# Altium schematic sheet PowerSupply.SchDoc: PowerSupply
size A3; Author: Carlos Barreiro; Organization: Escuela Técnica Superior de Ingeniería de Sistemas Informáticos de la Universidad Politécnica de Madrid; Address1: Campus Sur de la Universidad Politécnica de Madrid; Address2: Calle de Alan Turing, s/nº; Address3: Madrid 28031; Address4: España; DocumentNumber: 11; SheetNumber: 11; SheetTotal: 16
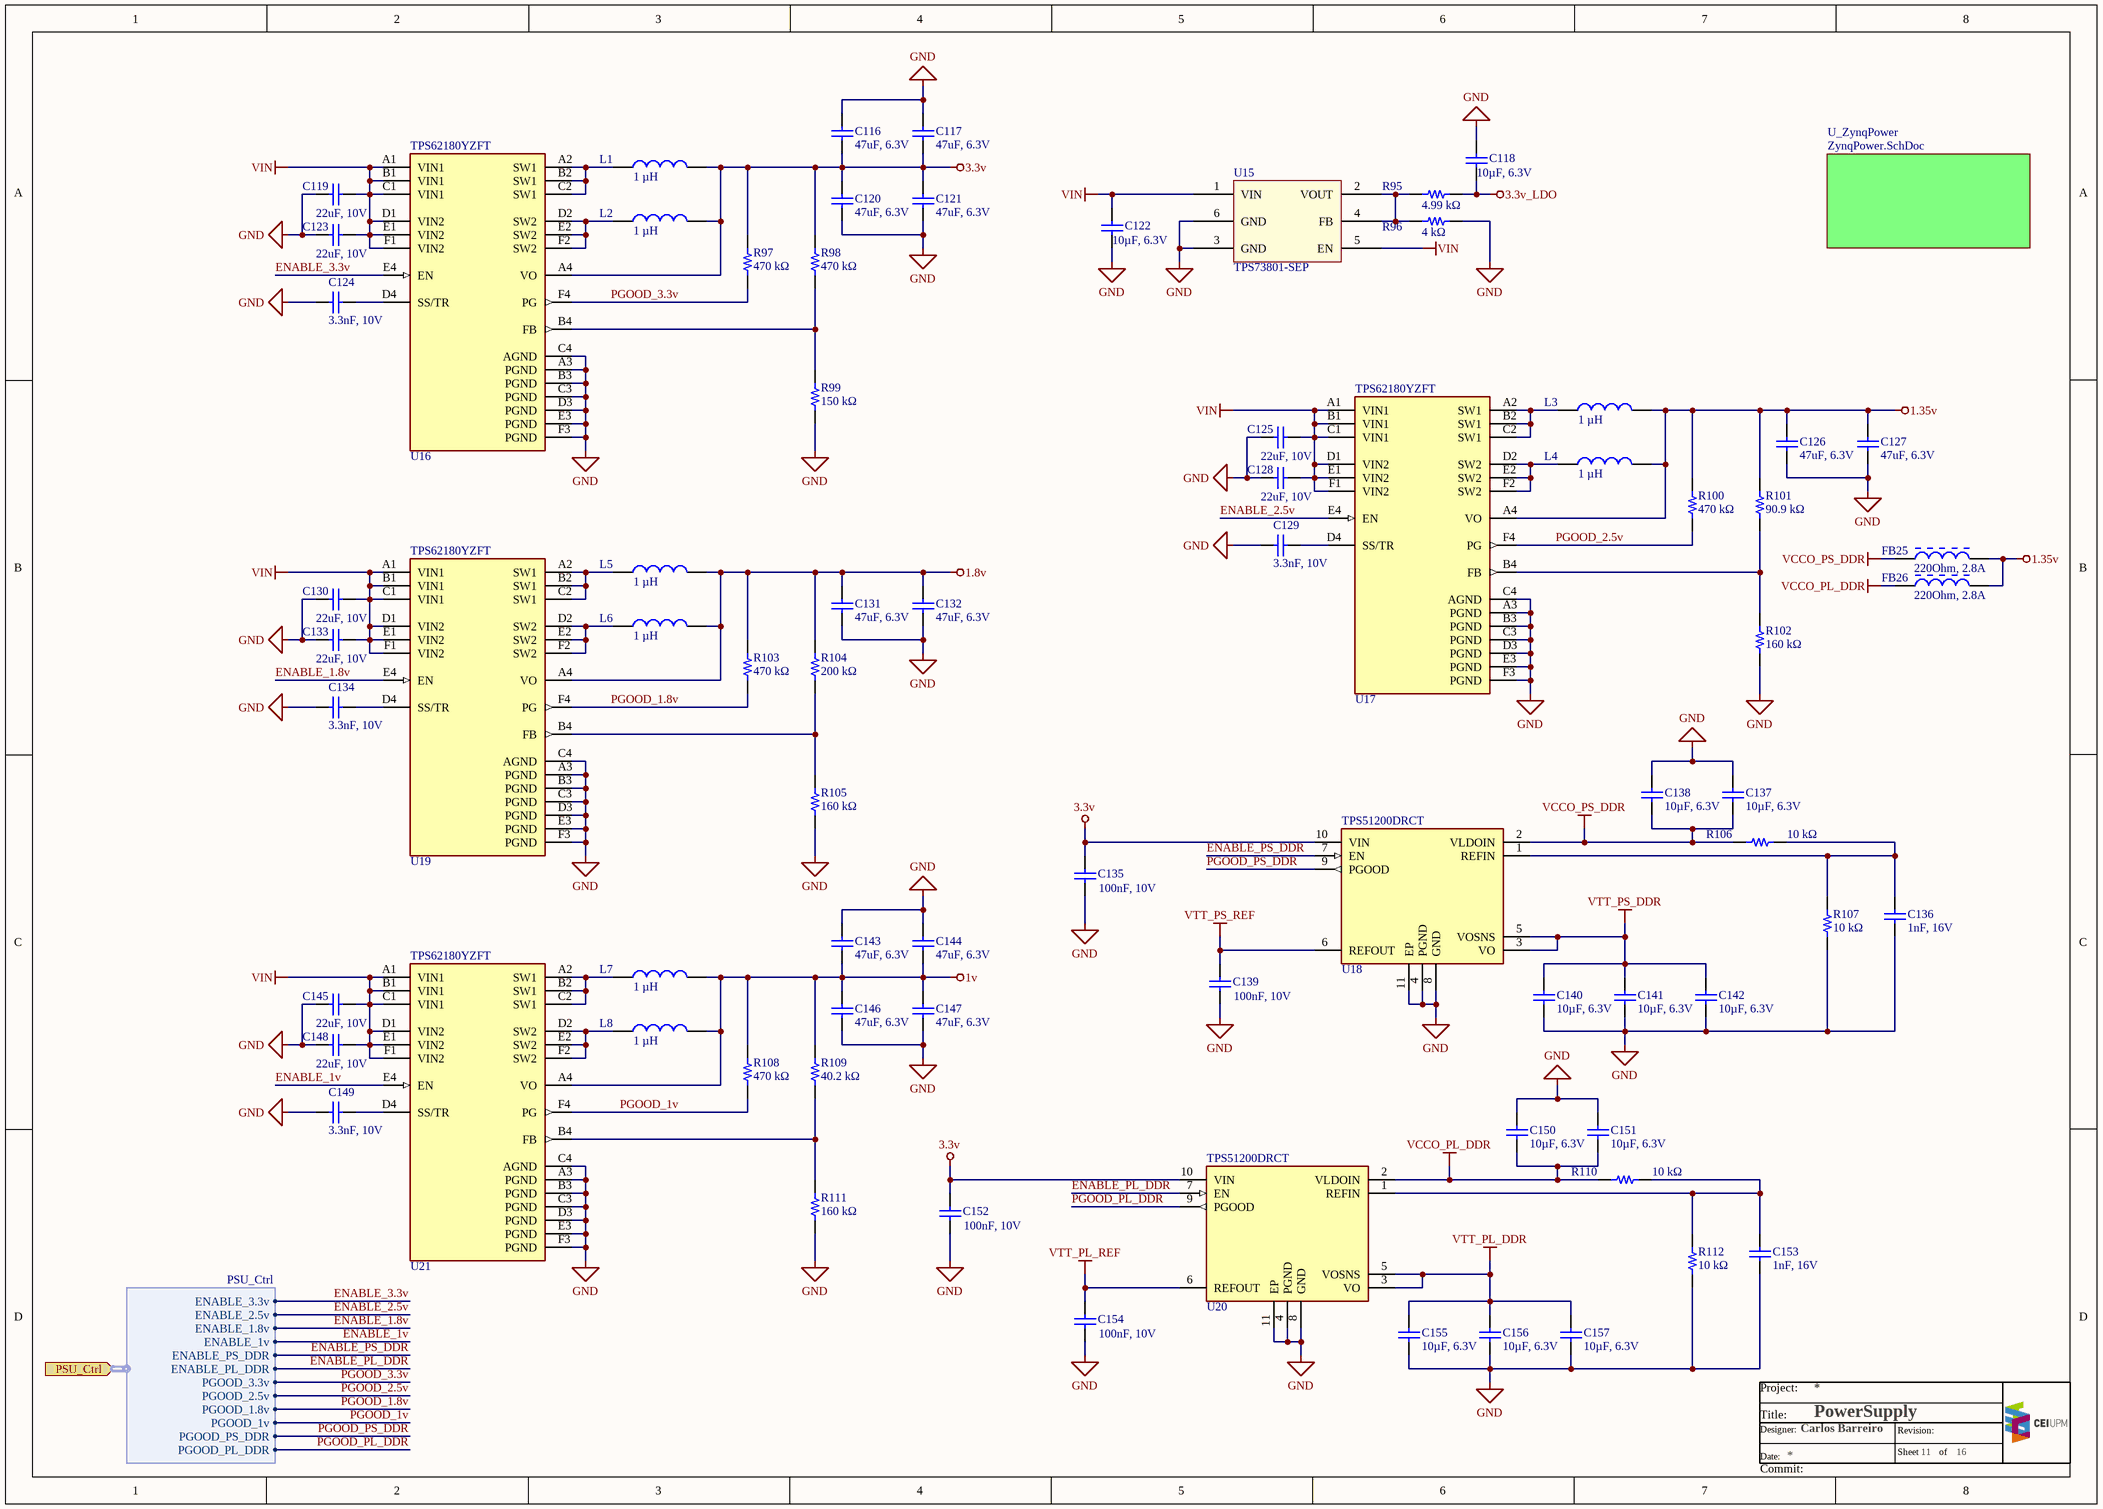
[diagram p0: PowerSupply.SchDoc]

## Parts
C116  47uF, 6.3V  [WURTH_WCAP-CSGP_0805_H=1.25mm]
C117  47uF, 6.3V  [WURTH_WCAP-CSGP_0805_H=1.25mm]
C118  10µF, 6.3V  [WURTH_WCAP-CSGP_0402]
C119  22uF, 10V  [WURTH_WCAP-CSGP_0805_H=1.25mm]
C120  47uF, 6.3V  [WURTH_WCAP-CSGP_0805_H=1.25mm]
C121  47uF, 6.3V  [WURTH_WCAP-CSGP_0805_H=1.25mm]
C122  10µF, 6.3V  [WURTH_WCAP-CSGP_0402]
C123  22uF, 10V  [WURTH_WCAP-CSGP_0805_H=1.25mm]
C124  3.3nF, 10V  [WURTH_WCAP-CSGP_0402]
C125  22uF, 10V  [WURTH_WCAP-CSGP_0805_H=1.25mm]
C126  47uF, 6.3V  [WURTH_WCAP-CSGP_0805_H=1.25mm]
C127  47uF, 6.3V  [WURTH_WCAP-CSGP_0805_H=1.25mm]
C128  22uF, 10V  [WURTH_WCAP-CSGP_0805_H=1.25mm]
C129  3.3nF, 10V  [WURTH_WCAP-CSGP_0402]
C130  22uF, 10V  [WURTH_WCAP-CSGP_0805_H=1.25mm]
C131  47uF, 6.3V  [WURTH_WCAP-CSGP_0805_H=1.25mm]
C132  47uF, 6.3V  [WURTH_WCAP-CSGP_0805_H=1.25mm]
C133  22uF, 10V  [WURTH_WCAP-CSGP_0805_H=1.25mm]
C134  3.3nF, 10V  [WURTH_WCAP-CSGP_0402]
C135  100nF, 10V  [WURTH_WCAP-CSGP_0402]
C136  1nF, 16V  [WURTH_WCAP-CSGP_0402]
C137  10µF, 6.3V  [WURTH_WCAP-CSGP_0402]
C138  10µF, 6.3V  [WURTH_WCAP-CSGP_0402]
C139  100nF, 10V  [WURTH_WCAP-CSGP_0402]
C140  10µF, 6.3V  [WURTH_WCAP-CSGP_0402]
C141  10µF, 6.3V  [WURTH_WCAP-CSGP_0402]
C142  10µF, 6.3V  [WURTH_WCAP-CSGP_0402]
C143  47uF, 6.3V  [WURTH_WCAP-CSGP_0805_H=1.25mm]
C144  47uF, 6.3V  [WURTH_WCAP-CSGP_0805_H=1.25mm]
C145  22uF, 10V  [WURTH_WCAP-CSGP_0805_H=1.25mm]
C146  47uF, 6.3V  [WURTH_WCAP-CSGP_0805_H=1.25mm]
C147  47uF, 6.3V  [WURTH_WCAP-CSGP_0805_H=1.25mm]
C148  22uF, 10V  [WURTH_WCAP-CSGP_0805_H=1.25mm]
C149  3.3nF, 10V  [WURTH_WCAP-CSGP_0402]
C150  10µF, 6.3V  [WURTH_WCAP-CSGP_0402]
C151  10µF, 6.3V  [WURTH_WCAP-CSGP_0402]
C152  100nF, 10V  [WURTH_WCAP-CSGP_0402]
C153  1nF, 16V  [WURTH_WCAP-CSGP_0402]
C154  100nF, 10V  [WURTH_WCAP-CSGP_0402]
C155  10µF, 6.3V  [WURTH_WCAP-CSGP_0402]
C156  10µF, 6.3V  [WURTH_WCAP-CSGP_0402]
C157  10µF, 6.3V  [WURTH_WCAP-CSGP_0402]
FB25  220Ohm, 2.8A  [WURTH-CBF_0805]
FB26  220Ohm, 2.8A  [WURTH-CBF_0805]
L1  1 µH  [Murata_LQH2HPN_JR]
L2  1 µH  [Murata_LQH2HPN_JR]
L3  1 µH  [Murata_LQH2HPN_JR]
L4  1 µH  [Murata_LQH2HPN_JR]
L5  1 µH  [Murata_LQH2HPN_JR]
L6  1 µH  [Murata_LQH2HPN_JR]
L7  1 µH  [Murata_LQH2HPN_JR]
L8  1 µH  [Murata_LQH2HPN_JR]
R95  4.99 kΩ  [PANASONIC_ERJ2G_0402]
R96  4 kΩ  [PANASONIC_ERJ2G_0402]
R97  470 kΩ  [PANASONIC_ERJ2G_0402]
R98  470 kΩ  [PANASONIC_ERJ2G_0402]
R99  150 kΩ  [PANASONIC_ERJ2G_0402]
R100  470 kΩ  [PANASONIC_ERJ2G_0402]
R101  90.9 kΩ  [PANASONIC_ERJ2G_0402]
R102  160 kΩ  [PANASONIC_ERJ2G_0402]
R103  470 kΩ  [PANASONIC_ERJ2G_0402]
R104  200 kΩ  [PANASONIC_ERJ2G_0402]
R105  160 kΩ  [PANASONIC_ERJ2G_0402]
R106  10 kΩ  [PANASONIC_ERJ2G_0402]
R107  10 kΩ  [PANASONIC_ERJ2G_0402]
R108  470 kΩ  [PANASONIC_ERJ2G_0402]
R109  40.2 kΩ  [PANASONIC_ERJ2G_0402]
R110  10 kΩ  [PANASONIC_ERJ2G_0402]
R111  160 kΩ  [PANASONIC_ERJ2G_0402]
R112  10 kΩ  [PANASONIC_ERJ2G_0402]
U15  TPS73801-SEP  [TEXAS_SOT223DCQ]
U16  TPS62180YZFT  [TEXAS_DSBGA24]
U17  TPS62180YZFT  [TEXAS_DSBGA24]
U18  TPS51200DRCT  [TEXAS_VSON10]
U19  TPS62180YZFT  [TEXAS_DSBGA24]
U20  TPS51200DRCT  [TEXAS_VSON10]
U21  TPS62180YZFT  [TEXAS_DSBGA24]

## Sub-sheets
U_ZynqPower = ZynqPower.SchDoc: no entries

## Ports
PSU_Ctrl (in, harness PSU_Ctrl)

## Harnesses
PSU_Ctrl: ENABLE_3.3v, ENABLE_2.5v, ENABLE_1.8v, ENABLE_1v, ENABLE_PS_DDR, ENABLE_PL_DDR, PGOOD_3.3v, PGOOD_2.5v, PGOOD_1.8v, PGOOD_1v, PGOOD_PS_DDR, PGOOD_PL_DDR

## Nets
1.8v: C131.2 C132.2 L5.2 L6.2 R103.2 R104.2 U19.A4(VO)
1.35v: C126.2 C127.2 FB25.2 FB26.2 L3.2 L4.2 R100.2 R101.2 U17.A4(VO)
1v: C143.1 C144.1 C146.2 C147.2 L7.2 L8.2 R108.2 R109.2 U21.A4(VO)
3.3v: C116.1 C117.1 C120.2 C121.2 C135.2 C152.2 L1.2 L2.2 R97.2 R98.2 U16.A4(VO) U18.10(VIN) U20.10(VIN)
3.3v_LDO: C118.1 R95.2
GND: C116.2 C117.2 C118.2 C119.2 C120.1 C121.1 C122.1 C123.2 C124.1 C125.2 C126.1 C127.1 C128.2 C129.1 C130.2 C131.1 C132.1 C133.2 C134.1 C135.1 C136.2 C137.1 C138.1 C139.1 C140.1 C141.1 C142.1 C143.2 C144.2 C145.2 C146.1 C147.1 C148.2 C149.1 C150.1 C151.1 C152.1 C153.2 C154.1 C155.1 C156.1 C157.1 R96.2 R99.1 R102.1 R105.1 R107.1 R111.1 R112.1 U15.3(GND) U15.6(GND) U16.A3(PGND) U16.B3(PGND) U16.C3(PGND) U16.C4(AGND) U16.D3(PGND) U16.E3(PGND) U16.F3(PGND) U17.A3(PGND) U17.B3(PGND) U17.C3(PGND) U17.C4(AGND) U17.D3(PGND) U17.E3(PGND) U17.F3(PGND) U18.4(PGND) U18.8(GND) U18.11(EP) U19.A3(PGND) U19.B3(PGND) U19.C3(PGND) U19.C4(AGND) U19.D3(PGND) U19.E3(PGND) U19.F3(PGND) U20.4(PGND) U20.8(GND) U20.11(EP) U21.A3(PGND) U21.B3(PGND) U21.C3(PGND) U21.C4(AGND) U21.D3(PGND) U21.E3(PGND) U21.F3(PGND)
VCCO_PL_DDR: C150.2 C151.2 FB26.1 R110.1 U20.2(VLDOIN)
VCCO_PS_DDR: C137.2 C138.2 FB25.1 R106.1 U18.2(VLDOIN)
VIN: C119.1 C122.2 C123.1 C125.1 C128.1 C130.1 C133.1 C145.1 C148.1 U15.1(VIN) U15.5(EN) U16.A1(VIN1) U16.B1(VIN1) U16.C1(VIN1) U16.D1(VIN2) U16.E1(VIN2) U16.F1(VIN2) U17.A1(VIN1) U17.B1(VIN1) U17.C1(VIN1) U17.D1(VIN2) U17.E1(VIN2) U17.F1(VIN2) U19.A1(VIN1) U19.B1(VIN1) U19.C1(VIN1) U19.D1(VIN2) U19.E1(VIN2) U19.F1(VIN2) U21.A1(VIN1) U21.B1(VIN1) U21.C1(VIN1) U21.D1(VIN2) U21.E1(VIN2) U21.F1(VIN2)
VTT_PL_DDR: C155.2 C156.2 C157.2 U20.3(VO) U20.5(VOSNS)
VTT_PL_REF: C154.2 U20.6(REFOUT)
VTT_PS_DDR: C140.2 C141.2 C142.2 U18.3(VO) U18.5(VOSNS)
VTT_PS_REF: C139.2 U18.6(REFOUT)
ENABLE_1.8v: U19.E4(EN) ; port PSU_Ctrl.ENABLE_1.8v
ENABLE_1v: U21.E4(EN) ; port PSU_Ctrl.ENABLE_1v
ENABLE_2.5v: U17.E4(EN) ; port PSU_Ctrl.ENABLE_2.5v
ENABLE_3.3v: U16.E4(EN) ; port PSU_Ctrl.ENABLE_3.3v
ENABLE_PL_DDR: U20.7(EN) ; port PSU_Ctrl.ENABLE_PL_DDR
ENABLE_PS_DDR: U18.7(EN) ; port PSU_Ctrl.ENABLE_PS_DDR
PGOOD_1.8v: R103.1 U19.F4(PG) ; port PSU_Ctrl.PGOOD_1.8v
PGOOD_1v: R108.1 U21.F4(PG) ; port PSU_Ctrl.PGOOD_1v
PGOOD_2.5v: R100.1 U17.F4(PG) ; port PSU_Ctrl.PGOOD_2.5v
PGOOD_3.3v: R97.1 U16.F4(PG) ; port PSU_Ctrl.PGOOD_3.3v
PGOOD_PL_DDR: U20.9(PGOOD) ; port PSU_Ctrl.PGOOD_PL_DDR
PGOOD_PS_DDR: U18.9(PGOOD) ; port PSU_Ctrl.PGOOD_PS_DDR
NetC124_2: C124.2 U16.D4(SS/TR)
NetC129_2: C129.2 U17.D4(SS/TR)
NetC134_2: C134.2 U19.D4(SS/TR)
NetC136_1: C136.1 R106.2 R107.2 U18.1(REFIN)
NetC149_2: C149.2 U21.D4(SS/TR)
NetC153_1: C153.1 R110.2 R112.2 U20.1(REFIN)
NetL1_1: L1.1 U16.A2(SW1) U16.B2(SW1) U16.C2(SW1)
NetL2_1: L2.1 U16.D2(SW2) U16.E2(SW2) U16.F2(SW2)
NetL3_1: L3.1 U17.A2(SW1) U17.B2(SW1) U17.C2(SW1)
NetL4_1: L4.1 U17.D2(SW2) U17.E2(SW2) U17.F2(SW2)
NetL5_1: L5.1 U19.A2(SW1) U19.B2(SW1) U19.C2(SW1)
NetL6_1: L6.1 U19.D2(SW2) U19.E2(SW2) U19.F2(SW2)
NetL7_1: L7.1 U21.A2(SW1) U21.B2(SW1) U21.C2(SW1)
NetL8_1: L8.1 U21.D2(SW2) U21.E2(SW2) U21.F2(SW2)
NetR95_1: R95.1 R96.1 U15.2(VOUT) U15.4(FB)
NetR98_1: R98.1 R99.2 U16.B4(FB)
NetR101_1: R101.1 R102.2 U17.B4(FB)
NetR104_1: R104.1 R105.2 U19.B4(FB)
NetR109_1: R109.1 R111.2 U21.B4(FB)

## Notes on the sheet
- Project:
- Title:
- Date:
- Designer:
- Sheet
- Revision:
- of
- Commit:

## Library data of the parts
C116 C117 C120 C121 C126 C127 C131 C132 C143 C144 C146 C147 = 885012107006: WCAP-CSGP Multilayer Ceramic Chip Capacitor, General Purpose, size 0805, X5R, 47uF, 6.3V; Manufacturer: Wurth Elektronik; Rated Voltage: 6.3VDC; Isolation Resistance  min.: 0.002GOhm; Capacitance Tolerance: +/-20%; Dissipation Factor max.: 10%; Technical Reference: X5R0805476M6R3DFCT10000; ComponentLink1Description: Manufacturer; ComponentLink1URL: http://www.we-online.de; ComponentLink2Description: Datasheet; ComponentLink2URL: https://www.we-online.com/catalog/datasheet/885012107006.pdf; Operating Temperature: -55 to +85degC; Packaging: Tape and Reel; Manufacturer Part Number: 885012107006; Published Date: April 2021; Ceramic Type: X5R; Height: 1.25mm; Mounting Technology: SMT; Size: 0805; Capacitance: 47uF; Q-Factor min.: -
C118 C122 C137 C138 C140-C142 C150 C151 C155-C157 = 885012105020: WCAP-CSGP Multilayer Ceramic Chip Capacitor, General Purpose, size 0402, X5R, 10uF, 6.3V; Manufacturer: Wurth Elektronik; Rated Voltage: 6.3VDC; Isolation Resistance  min.: 0.01GOhm; Capacitance Tolerance: +/20%; Dissipation Factor max.: 10%; Technical Reference: X5R0402106M6R3DFCT10000; ComponentLink1Description: Manufacturer; ComponentLink1URL: http://www.we-online.de; ComponentLink2Description: Datasheet; ComponentLink2URL: https://www.we-online.com/catalog/datasheet/885012105020.pdf; Operating Temperature: -55 to +85degC; Packaging: Tape and Reel; Manufacturer Part Number: 885012105020; Published Date: April 2021; Ceramic Type: X5R; Height: 0.5mm; Mounting Technology: SMT; Size: 0402; Capacitance: 10uF; Q-Factor min.: -
C119 C123 C125 C128 C130 C133 C145 C148 = 885012107011: WCAP-CSGP Multilayer Ceramic Chip Capacitor, General Purpose, size 0805, X5R, 22uF, 10V; Manufacturer: Wurth Elektronik; Rated Voltage: 10VDC; Isolation Resistance  min.: 0.005GOhm; Capacitance Tolerance: +/-20%; Dissipation Factor max.: 10%; Technical Reference: X5R0805226M010DFCT10000; ComponentLink1Description: Manufacturer; ComponentLink1URL: http://www.we-online.de; ComponentLink2Description: Datasheet; ComponentLink2URL: https://www.we-online.com/catalog/datasheet/885012107011.pdf; Operating Temperature: -55 to +85degC; Packaging: Tape and Reel; Manufacturer Part Number: 885012107011; Published Date: April 2021; Ceramic Type: X5R; Height: 1.25mm; Mounting Technology: SMT; Size: 0805; Capacitance: 22uF; Q-Factor min.: -
C124 C129 C134 C149 = 885012205009: WCAP-CSGP Multilayer Ceramic Chip Capacitor, General Purpose, size 0402, X7R, 3.3nF, 10V; Manufacturer: Wurth Elektronik; Rated Voltage: 10VDC; Isolation Resistance  min.: 10GOhm; Capacitance Tolerance: +/-10%; Dissipation Factor max.: 5%; Technical Reference: X7R0402332K010DFCT10000; ComponentLink1Description: Manufacturer; ComponentLink1URL: http://www.we-online.de; ComponentLink2Description: Datasheet; ComponentLink2URL: https://www.we-online.com/catalog/datasheet/885012205009.pdf; Operating Temperature: -55 to +125degC; Packaging: Tape and Reel; Manufacturer Part Number: 885012205009; Published Date: April 2021; Ceramic Type: X7R; Height: 0.5mm; Mounting Technology: SMT; Size: 0402; Capacitance: 3.3nF; Q-Factor min.: -
C135 C139 C152 C154 = 885012205018: WCAP-CSGP Multilayer Ceramic Chip Capacitor, General Purpose, size 0402, X7R, 100nF, 10V; Manufacturer: Wurth Elektronik; Rated Voltage: 10VDC; Isolation Resistance  min.: 5GOhm; Capacitance Tolerance: +/-10%; Dissipation Factor max.: 5%; Technical Reference: X7R0402104K010DFCT10000; ComponentLink1Description: Manufacturer; ComponentLink1URL: http://www.we-online.de; ComponentLink2Description: Datasheet; ComponentLink2URL: https://www.we-online.com/catalog/datasheet/885012205018.pdf; Operating Temperature: -55 to +125degC; Packaging: Tape and Reel; Manufacturer Part Number: 885012205018; Published Date: April 2021; Ceramic Type: X7R; Height: 0.5mm; Mounting Technology: SMT; Size: 0402; Capacitance: 100nF; Q-Factor min.: -
C136 C153 = 885012205025: WCAP-CSGP Multilayer Ceramic Chip Capacitor, General Purpose, size 0402, X7R, 1nF, 16V; Manufacturer: Wurth Elektronik; Rated Voltage: 16VDC; Isolation Resistance  min.: 10GOhm; Capacitance Tolerance: +/-10%; Dissipation Factor max.: 3.5%; Technical Reference: X7R0402102K016DFCT10000; ComponentLink1Description: Manufacturer; ComponentLink1URL: http://www.we-online.de; ComponentLink2Description: Datasheet; ComponentLink2URL: https://www.we-online.com/catalog/datasheet/885012205025.pdf; Operating Temperature: -55 to +125degC; Packaging: Tape and Reel; Manufacturer Part Number: 885012205025; Published Date: April 2021; Ceramic Type: X7R; Height: 0.5mm; Mounting Technology: SMT; Size: 0402; Capacitance: 1nF; Q-Factor min.: -
FB25 FB26 = 742792034: WE-CBF SMT EMI Suppression Ferrite Bead, size 0805, 220Ohm, 2.8A; Manufacturer: Wurth Elektronik; Impedance max.: 300Ohm; DC Resistance max.: 0.3Ohm; Type: High Speed; ComponentLink1Description: Manufacturer; ComponentLink1URL: http://www.we-online.de; ComponentLink2Description: Datasheet; ComponentLink2URL: https://www.we-online.com/catalog/datasheet/742792034.pdf; Operating Temperature: -55 to +125degC; Packaging: Tape and Reel; Published Date: December 2021; Rated Current: 2.8A; Manufacturer Part Number: 742792034; Impedance @100MHz: 220Ohm; Mounting Technology: SMT; Size: 0805; Height: 0.9mm; Length: 2mm; Width: 1.2mm
L1-L8 = LQH2HPN1R0NJR: Wire Wound Ferrite Inductor; Manufacturer: Murata; Inductance: 470 nH - 22 µH; AEC 200: Grade 0; Length (mm): 2.5; Width (mm): 2; ComponentLink1Description: Manufacturer; ComponentLink1URL: https://www.murata.com/search/productsearch?cate=cgInductors&partno=LQH2HPN_JR&realtime=1&sort=d_inductance; Height (mm): 1.2; Operating temperature range (C): −40°C to +125°C; Series: LQH2HPN_JR; Supplier 1: Digi-Key; Supplier 2: Mouser; Supplier Part Number 1: 490-9898-1-ND; Supplier Part Number 2: 81-LQH2HPN1R0NJRL
R95 = ERJ2RKF4991X: General Purpose Thick Film Chip Resistors; Manufacturer: Panasonic; Power (0402): 0.1 W; Limiting Voltage (0402): 50; Maximum Voltage (0402): 100; Resistance Range (Ω): 1Ω to 100MΩ; AEC 200: Grade 0; Size (0402): 2GE; ComponentLink1Description: Catalog; ComponentLink1URL: https://industrial.panasonic.com/ww/products/pt/general-purpose-chip-resistors/models?op=search&model_status_current=1&page=0#model-list-search-results; Series: ERJ; Temperature Range (ºC): -55 to +155; Supplier 1: Digi-Key; Supplier Part Number 1: P4.99KLTR-ND
R96 = ERJ2RKF4021X: General Purpose Thick Film Chip Resistors; Manufacturer: Panasonic; Power (0402): 0.1 W; Limiting Voltage (0402): 50; Maximum Voltage (0402): 100; Resistance Range (Ω): 1Ω to 100MΩ; AEC 200: Grade 0; Size (0402): 2GE; ComponentLink1Description: Catalog; ComponentLink1URL: https://industrial.panasonic.com/ww/products/pt/general-purpose-chip-resistors/models?op=search&model_status_current=1&page=0#model-list-search-results; Series: ERJ; Temperature Range (ºC): -55 to +155; Supplier 1: Digi-Key; Supplier 2: Digi-Key; Supplier Part Number 2: P4.02KLDKR-ND; Supplier Part Number 1: P4.02KLCT-ND
R97 R98 R100 R103 R108 = ERJ2RKF4703X: General Purpose Thick Film Chip Resistors; Manufacturer: Panasonic; Power (0402): 0.1 W; Limiting Voltage (0402): 50; Maximum Voltage (0402): 100; Resistance Range (Ω): 1Ω to 100MΩ; AEC 200: Grade 0; Size (0402): 2GE; ComponentLink1Description: Catalog; ComponentLink1URL: https://industrial.panasonic.com/ww/products/pt/general-purpose-chip-resistors/models?op=search&model_status_current=1&page=0#model-list-search-results; Series: ERJ; Temperature Range (ºC): -55 to +155; Supplier 1: Digi-Key; Supplier Part Number 1: P470KLCT-ND
R99 = ERJ2RKF1503X: General Purpose Thick Film Chip Resistors; Manufacturer: Panasonic; Power (0402): 0.1 W; Limiting Voltage (0402): 50; Maximum Voltage (0402): 100; Resistance Range (Ω): 1Ω to 100MΩ; AEC 200: Grade 0; Size (0402): 2GE; ComponentLink1Description: Catalog; ComponentLink1URL: https://industrial.panasonic.com/ww/products/pt/general-purpose-chip-resistors/models?op=search&model_status_current=1&page=0#model-list-search-results; Series: ERJ; Temperature Range (ºC): -55 to +155; Supplier 1: Digi-Key; Supplier Part Number 1: P150KLCT-ND
R101 = ERJ2RKF9092X: General Purpose Thick Film Chip Resistors; Manufacturer: Panasonic; Power (0402): 0.1 W; Limiting Voltage (0402): 50; Maximum Voltage (0402): 100; Resistance Range (Ω): 1Ω to 100MΩ; AEC 200: Grade 0; Size (0402): 2GE; ComponentLink1Description: Catalog; ComponentLink1URL: https://industrial.panasonic.com/ww/products/pt/general-purpose-chip-resistors/models?op=search&model_status_current=1&page=0#model-list-search-results; Series: ERJ; Temperature Range (ºC): -55 to +155; Supplier 1: Mouser; Supplier Part Number 1: 667-ERJ-2RKF9092X; Supplier 2: Digi-Key; Supplier Part Number 2: P90.9KLCT-ND
R102 R105 R111 = ERJ2RKF1603X: General Purpose Thick Film Chip Resistors; Manufacturer: Panasonic; Power (0402): 0.1 W; Limiting Voltage (0402): 50; Maximum Voltage (0402): 100; Resistance Range (Ω): 1Ω to 100MΩ; AEC 200: Grade 0; Size (0402): 2GE; ComponentLink1Description: Catalog; ComponentLink1URL: https://industrial.panasonic.com/ww/products/pt/general-purpose-chip-resistors/models?op=search&model_status_current=1&page=0#model-list-search-results; Series: ERJ; Temperature Range (ºC): -55 to +155; Supplier 1: Digi-Key; Supplier Part Number 1: P160KLCT-ND
R104 = ERJ2RKF2003X: General Purpose Thick Film Chip Resistors; Manufacturer: Panasonic; Power (0402): 0.1 W; Limiting Voltage (0402): 50; Maximum Voltage (0402): 100; Resistance Range (Ω): 1Ω to 100MΩ; AEC 200: Grade 0; Size (0402): 2GE; ComponentLink1Description: Catalog; ComponentLink1URL: https://industrial.panasonic.com/ww/products/pt/general-purpose-chip-resistors/models?op=search&model_status_current=1&page=0#model-list-search-results; Series: ERJ; Temperature Range (ºC): -55 to +155; Supplier 1: Digi-Key; Supplier Part Number 1: P200KLCT-ND
R106 R107 R110 R112 = ERJ2RKF1002X: General Purpose Thick Film Chip Resistors; Manufacturer: Panasonic; Power (0402): 0.1 W; Limiting Voltage (0402): 50; Maximum Voltage (0402): 100; Resistance Range (Ω): 1Ω to 100MΩ; AEC 200: Grade 0; Size (0402): 2GE; ComponentLink1Description: Catalog; ComponentLink1URL: https://industrial.panasonic.com/ww/products/pt/general-purpose-chip-resistors/models?op=search&model_status_current=1&page=0#model-list-search-results; Series: ERJ; Temperature Range (ºC): -55 to +155; Supplier 1: Digi-Key; Supplier 2: Mouser; Supplier Part Number 1: P10.0KLCT-ND; Supplier Part Number 2: 667-ERJ-2RKF1002X
R109 = ERJ2RKF4022X: General Purpose Thick Film Chip Resistors; Manufacturer: Panasonic; Power (0402): 0.1 W; Limiting Voltage (0402): 50; Maximum Voltage (0402): 100; Resistance Range (Ω): 1Ω to 100MΩ; AEC 200: Grade 0; Size (0402): 2GE; ComponentLink1Description: Catalog; ComponentLink1URL: https://industrial.panasonic.com/ww/products/pt/general-purpose-chip-resistors/models?op=search&model_status_current=1&page=0#model-list-search-results; Series: ERJ; Temperature Range (ºC): -55 to +155; Supplier 1: Digi-Key; Supplier Part Number 1: P40.2KLTR-ND
U15 = TPS73801-SEP: Radiation-hardened, 2.2-V to 20-V, 1-A low-noise adjustable output LDO in Space Enhanced Plastic; Iout (Max) (A): 1; Vin (Max) (V): 20; Vin (Min) (V): 2.2; Vout (Min) (V): 1.21; ComponentLink1Description: Manufacturer; ComponentLink1URL: https://www.ti.com/product/TPS73801-SEP#pps; ComponentLink2Description: Datasheet; ComponentLink2URL: https://www.ti.com/lit/ds/symlink/tps73801-sep.pdf?ts=1639038776346&ref_url=https%253A%252F%252Fwww.ti.com%252Fproduct%252FTPS73801-SEP; Vout (Max) (V): 20; Iq (Typ) (mA): 1; Operating temperature range (C): -55 to 125; Radiation, TID (Typ) (krad): 50; Radiation, SEL (MeV.cm2/mg): 43; Rating: Space
U16 U17 U19 U21 = TPS62180YZFT: TPS6218x 4-V to 15-V, 6-A, 2-Phase Step-Down Converters; Body Size (mm): 2.10 mm x 3.10 mm; Vin (Min) (V): 4; Vin (Max) (V): 15; Vout (Min) (V): 0.9; Vout (Max) (V): 6; Iq (Typ) (uA): 30; Switching frequency (Min) (kHz): 1000; Switching frequency (Max) (kHz): 2000; Rating: Catalog; Regulated outputs (#): 1; Package: DSBGA 24; Iout (Max) (A): 6; Operating temperature range (C): -40ºC to 125ºC; ComponentLink1Description: Manufacturer; ComponentLink1URL: https://www.ti.com/product/TPS62184; Supplier 1: Digi-Key; Supplier 2: Mouser; Supplier Part Number 1: 296-38369-6-ND; Supplier Part Number 2: 595-TPS62180YZFT
U18 U20 = TPS51200DRCT: 3A Sink/Source DDR Termination Regulator w/ VTTREF Buffered Reference for DDR2, DDR3, DDR3L and DDR4 10-VSON -40 to 85; MF: Texas Instruments; DDR memory type: DDR, DDR2, DDR3, DDR3L, LPDDR2, LPDDR3; Control mode: D-CAP, S4/S5; Iout VDDQ (Max) (A): 20; Iq (Typ) (mA): 0.6; Output: VDDQ, VREF, VTT; Vin (Min) (V): 3; Vin (Max) (V): 28; Rating: HiRel Enhanced Product; MP: TPS51200DRCT; Package: VSON-10; Supplier 1: Digi-Key; Supplier 2: Mouser; Supplier Part Number 1: 296-23830-1-ND; Supplier Part Number 2: 595-TPS51200DRCT; Iout VTT (Max) (A): *; Operating temperature range (C): -55ºC to 125ºC